# EAGLE design Camera_Trigger (EAGLE 9.5.2)
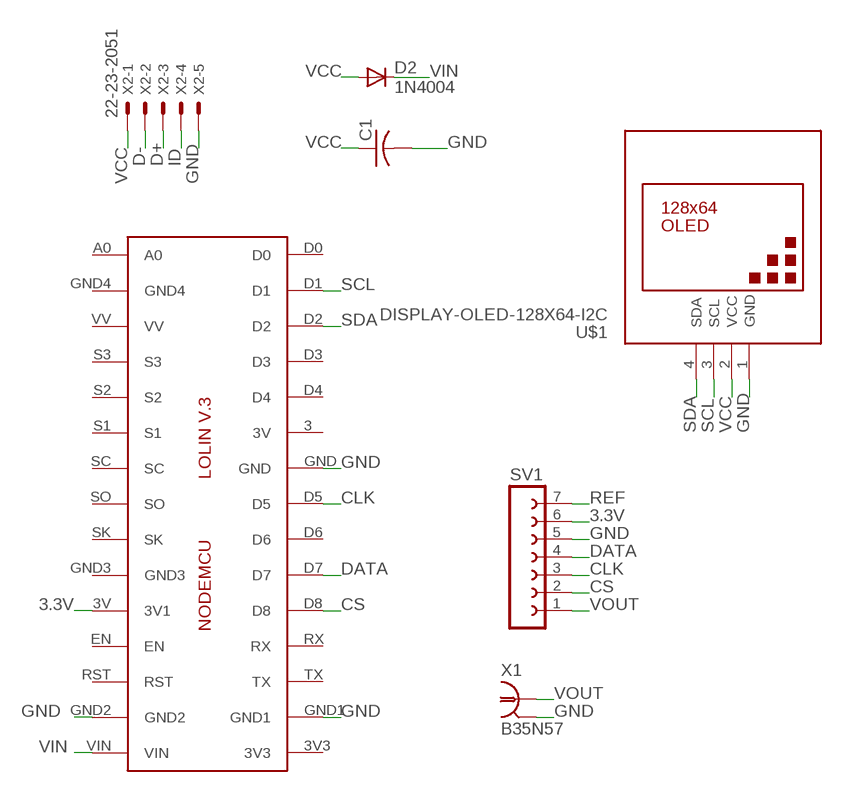
[diagram p0: schematic, sheet 1]

## Parts
C1  C-US025-040X050  [C025-040X050]
D2  1N4004  [DO41-10]
IC1  LOLINV3  [LOLINV3]
SV1  FE07-1  [FE07]
U$1  DISPLAY-OLED-128X64-I2C  [DISPLAY-OLED-128X64-I2C]
X1  B35N57  [B35N57]
X2  22-23-2051  [22-23-2051]

## Nets
3.3V: IC1.3V(3V1) SV1.6
CLK: IC1.D5 SV1.3
CS: IC1.D8 SV1.2
D+: X2.3
D-: X2.2
DATA: IC1.D7 SV1.4
GND: C1.2 IC1.GND IC1.GND1 IC1.GND2 SV1.5 U$1.1(GND) X1.2 X1.3 X1.4 X1.5 X2.5
ID: X2.4
REF: SV1.7
SCL: IC1.D1 U$1.3(SCL)
SDA: IC1.D2 U$1.4(SDA)
VCC: C1.1 D2.A U$1.2(VCC) X2.1
VIN: D2.C IC1.VIN
VOUT: SV1.1 X1.1
Unconnected: IC1.3(3V) IC1.3V3 IC1.A0 IC1.D0 IC1.D3 IC1.D4 IC1.D6 IC1.EN IC1.GND3 IC1.GND4 IC1.RST IC1.RX IC1.S1 IC1.S2 IC1.S3 IC1.SC IC1.SK IC1.SO IC1.TX IC1.VV

## Library data of the parts
C1 = adafruit:C-US: CAPACITOR, American symbol
D2 = adafruit:1N4004: DIODE General purpose 1N400x type rectifier (With bigger pads) http://www.ladyada.net/library/pcb/eaglelibrary.html
IC1 = Lolin:LOLINV3
SV1 = con-lsta:FE07-1: FEMALE HEADER; OC_FARNELL: unknown; OC_NEWARK: unknown
U$1 = diy-modules:DISPLAY-OLED-128X64-I2C: 128x64 Dot Matrix OLED Module based on SSD1306 chip Variant with I2C interface More details available here: http://www.instructables.com/id/Monochrome-096-i2c-OLED-display-with-arduino-SSD13/ SSD1306 datasheet: https://cdn-shop.adafruit.com/datasheets/SSD1306.pdf Click here to find device on ebay.com <http://www.ebay.com/sch/oled+display+128x64+iic> Note: There are two variants: I2C and SPI. Search for the proper version.
X1 = con-coax:B35N57: BNC CONNECTOR M/A COM www.macom.com; OC_FARNELL: unknown; OC_NEWARK: unknown
X2 = con-molex:22-23-2051: .100" (2.54mm) Center Header - 5 Pin; MF: MOLEX; MPN: 22-23-2051; OC_FARNELL: 1462952; OC_NEWARK: 38C9178

## Board
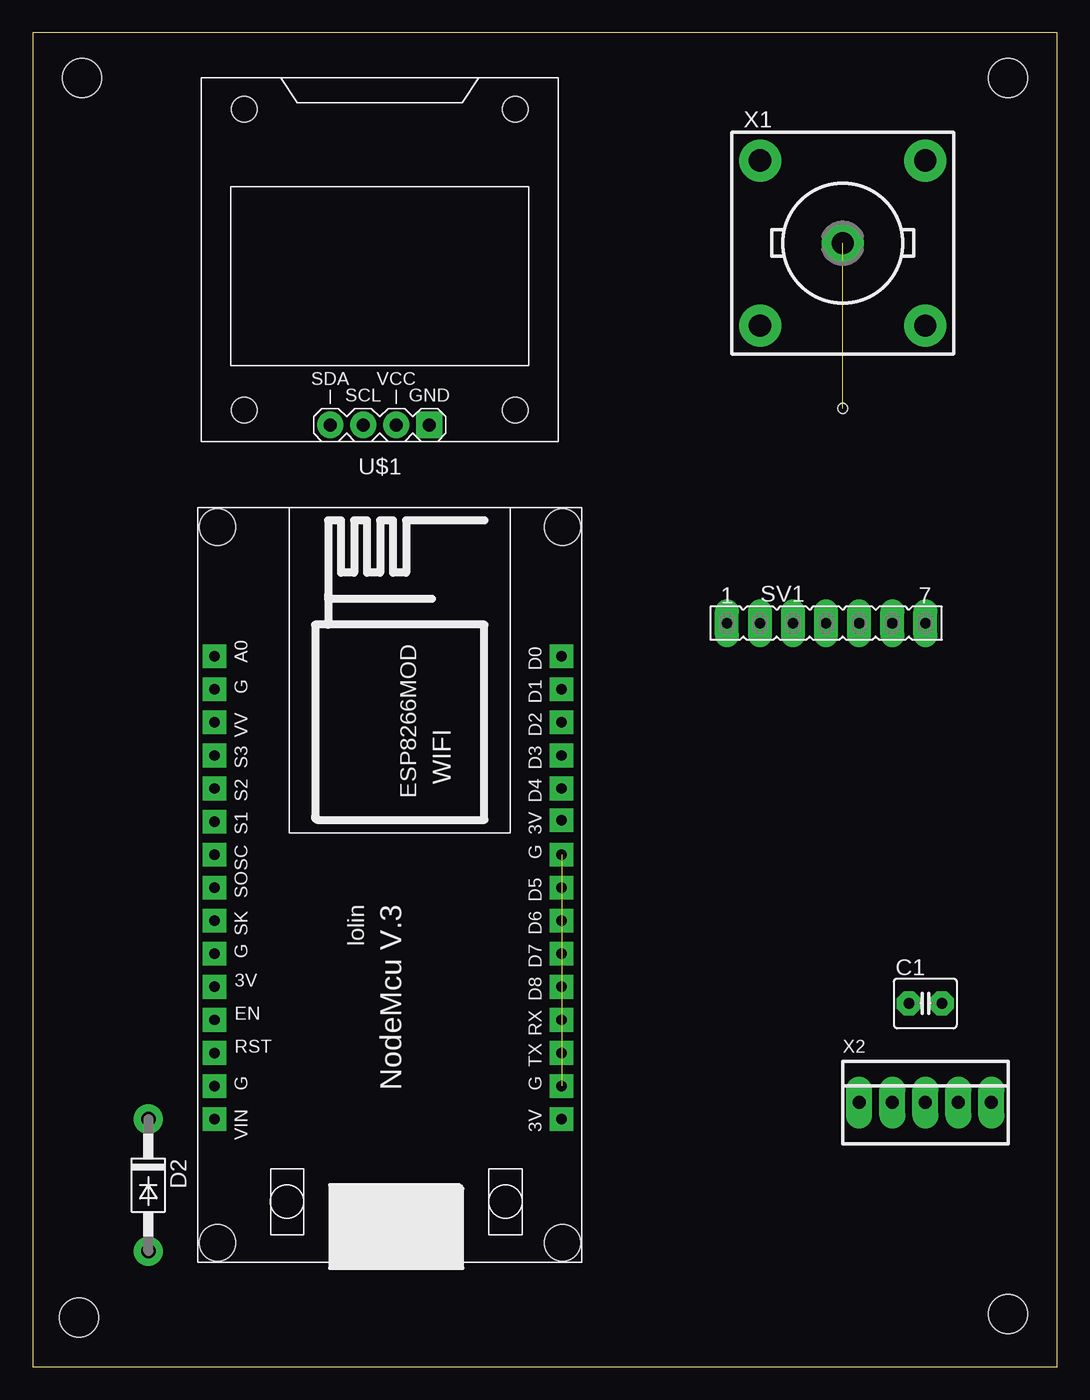
[diagram p1: board, top side]
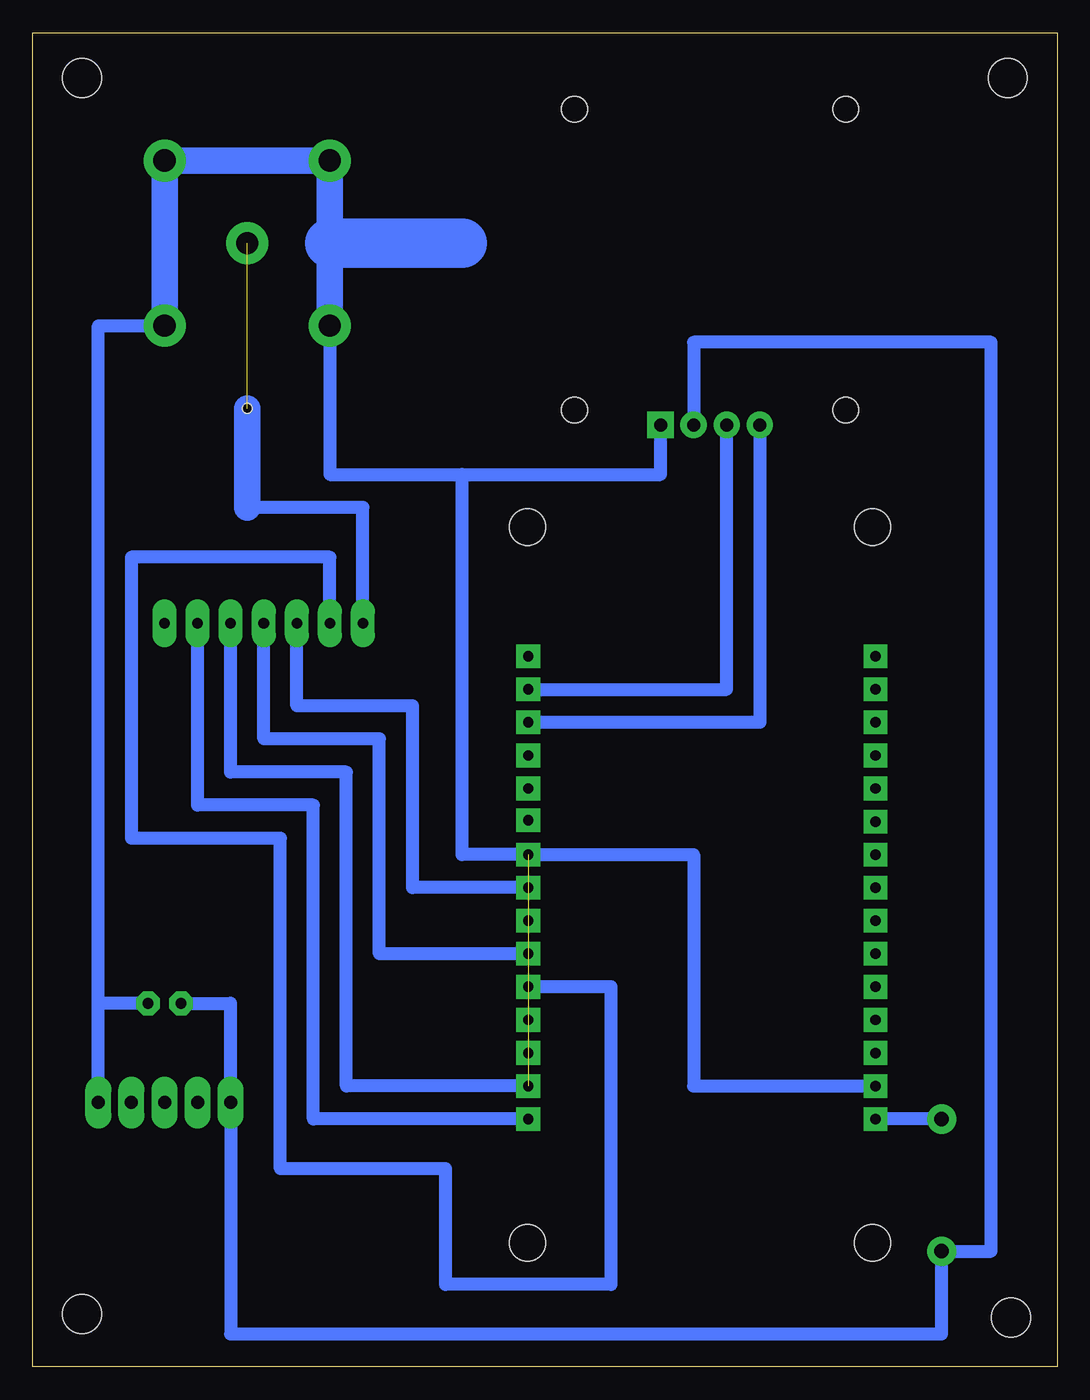
[diagram p2: board, bottom side, seen from below]

Size 78.72 x 102.54 mm. Coordinates in mm from the lower left corner, seen from the top.
Outline: 0,0 78.72,0 78.72,102.54 0,102.54 0,0
Copper layers (1*16): Top 0.035mm / dielectric 1.5mm / Bottom 0.035mm
Design rules "Old": minimum track width 1mm, minimum drill 1mm, track to track 16mil, track to pad 16mil, pad to pad 16mil, via to via 16mil, smd to smd 6mil, copper to edge 30mil, drill to drill 6mil, minimum pad ring 20mil, minimum via ring 8mil, stop-mask expansion 4mil, vias tented up to drill 0mil, thermal gap 10mil
Holes 3 mm at 3.81,99.06 74.93,99.06 3.56,3.81 74.93,4.06
Holes 0.76 mm at 62.23,73.66

### Footprints (pad centres in the part's own frame; a part is rotated, then mirrored left to right if it is on the bottom)
C025-040X050 = drill 0.813 pad 1.422 octagon: 1 -1.27,0; 2 1.27,0
DO41-10 = drill 1.118 pad 1.93: A 5.08,0; C -5.08,0
LOLINV3 = drill 0.8 pad 1.778 square: 3 24.03,27.94; 3V 46.99,27.94; 3V3 36.83,1.27; A0 11.43,1.27; D0 11.43,27.94; D1 13.97,27.94; D2 16.51,27.94; D3 19.05,27.94; D4 21.59,27.94; D5 29.21,27.94; D6 31.75,27.94; D7 34.29,27.94; D8 36.83,27.94; EN 39.37,1.27; GND 26.67,27.94; GND1 44.45,27.94; GND2 44.45,1.27; GND3 34.29,1.27; GND4 13.97,1.27; RST 41.91,1.27; RX 39.37,27.94; S1 24.13,1.27; S2 21.59,1.27; S3 19.05,1.27; SC 26.67,1.27; SK 31.75,1.27; SO 29.21,1.27; TX 41.91,27.94; VIN 46.99,1.27; VV 16.51,1.27 | hole 2.8: 56.5,28; 56.5,1.5; 1.5,1.5; 1.5,28
FE07 = drill 0.813 long: 1 -7.62,0; 2 -5.08,0; 3 -2.54,0; 4 0,0; 5 2.54,0; 6 5.08,0; 7 7.62,0
DISPLAY-OLED-128X64-I2C = drill 1 square: 1 -3.81,12.7 | drill 1: 2 -1.27,12.7; 3 1.27,12.7; 4 3.81,12.7 | hole 2: -10.414,11.557; 10.414,11.557; 10.414,-11.557; -10.414,-11.557
B35N57 = drill 1.7: 1 0,0; 2 6.35,6.35; 3 -6.35,6.35; 4 -6.35,-6.35; 5 6.35,-6.35
22-23-2051 = drill 1 long: 1 -5.08,0; 2 -2.54,0; 3 0,0; 4 2.54,0; 5 5.08,0

### Placement (x,y rotation side)
C1  68.58,27.94 0 top
D2  8.89,13.97 270 top
IC1  12.7,66.04 270 top
SV1  60.96,57.15 0 top
U$1  26.67,85.09 180 top
X1  62.23,86.36 0 top
X2  68.58,20.32 0 top

### Tracks (layer width: path | path; a pad name or v marks a point on that pad's centre or on a via)
3.3V
  Bottom 1: IC1.3V 57.15,19.05 57.15,43.18 66.04,43.18 SV1.6
CLK
  Bottom 1: IC1.D5 49.53,36.83 49.53,50.8 58.42,50.8 SV1.3
CS
  Bottom 1: SV1.2 55.88,62.23 71.12,62.23 71.12,40.64 59.69,40.64 59.69,15.24 46.99,15.24 46.99,6.35 34.29,6.35 34.29,29.21 IC1.D8
DATA
  Bottom 1: IC1.D7 52.07,31.75 52.07,48.26 60.96,48.26 SV1.4
GND  (1 unrouted)
  Bottom 1: IC1.GND1 54.61,21.59 54.61,45.72 63.5,45.72 SV1.5 | X2.5 73.66,27.94 | 73.66,27.94 73.66,80.01 X1.5 | 45.72,68.58 45.72,39.37 IC1.GND 27.94,39.37 27.94,21.59 IC1.GND2 | 45.72,68.58 30.48,68.58 U$1.1 | X1.4 55.88,68.58 45.72,68.58 | C1.2 73.66,27.94
  Bottom 2.032: X1.4 55.88,86.36 X1.3 X1.2 X1.5
  Bottom 3.81: 55.88,86.36 45.72,86.36
SCL
  Bottom 1: IC1.D1 25.4,52.07 U$1.3
SDA
  Bottom 1: U$1.4 22.86,49.53 IC1.D2
VCC
  Bottom 1: C1.1 63.5,27.94 X2.1 63.5,2.54 8.89,2.54 D2.A 5.08,8.89 5.08,78.74 27.94,78.74 U$1.2
VIN
  Bottom 1: D2.C IC1.VIN
VOUT  (1 unrouted)
  Bottom 1: SV1.1 53.34,66.04 62.23,66.04
  Bottom 2.032: 62.23,66.04 62.23,73.66